# EAGLE design Uart-to-rs232 (EAGLE 6.0)
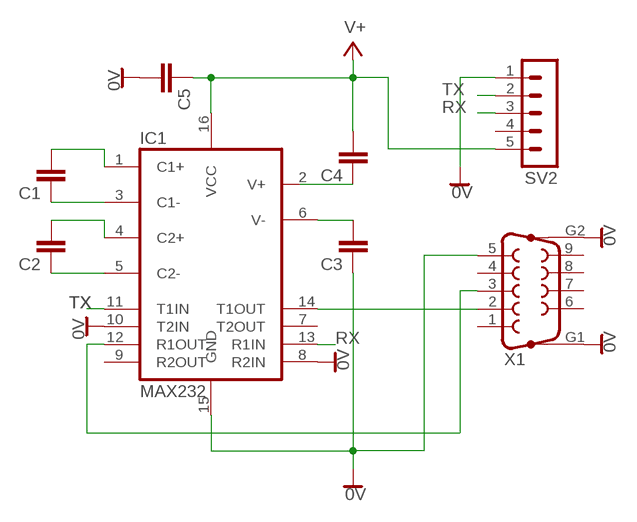
[diagram p0: schematic, sheet 1]

## Parts
C1  C0805  [C0805D]
C2  C0805  [C0805D]
C3  C0805  [C0805D]
C4  C0805  [C0805D]
C5  C0805  [C0805D]
IC1  MAX232  [DIL16]
SV2  MA05-1  [MA05-1]
X1  F09HP  [F09HP]

## Nets
0V: C3.1 C5.2 IC1.8(R2IN) IC1.10(T2IN) IC1.15(GND) SV2.1 X1.5 X1.G1 X1.G2
+5V: C4.2 C5.1 IC1.16(VCC) SV2.5 ; supply symbol labelled V+
N$1: IC1.14(T1OUT) X1.2
N$2: C1.2 IC1.1(C1+)
N$3: C1.1 IC1.3(C1-)
N$4: C2.2 IC1.4(C2+)
N$5: C2.1 IC1.5(C2-)
N$6: C3.2 IC1.6(V-)
N$7: C4.1 IC1.2(V+)
N$9: IC1.12(R1OUT) X1.3
RX: IC1.13(R1IN) SV2.3
TX: IC1.11(T1IN) SV2.2
Unconnected: IC1.7(T2OUT) IC1.9(R2OUT) SV2.4 X1.1 X1.4 X1.6 X1.7 X1.8 X1.9

## Library data of the parts
C1-C5 = den:C0805
IC1 = den:MAX232
SV2 = con-lstb:MA05-1: PIN HEADER; OC_FARNELL: unknown; OC_NEWARK: unknown
X1 = con-subd:F09HP: SUB-D; OC_FARNELL: unknown; OC_NEWARK: unknown

## Board
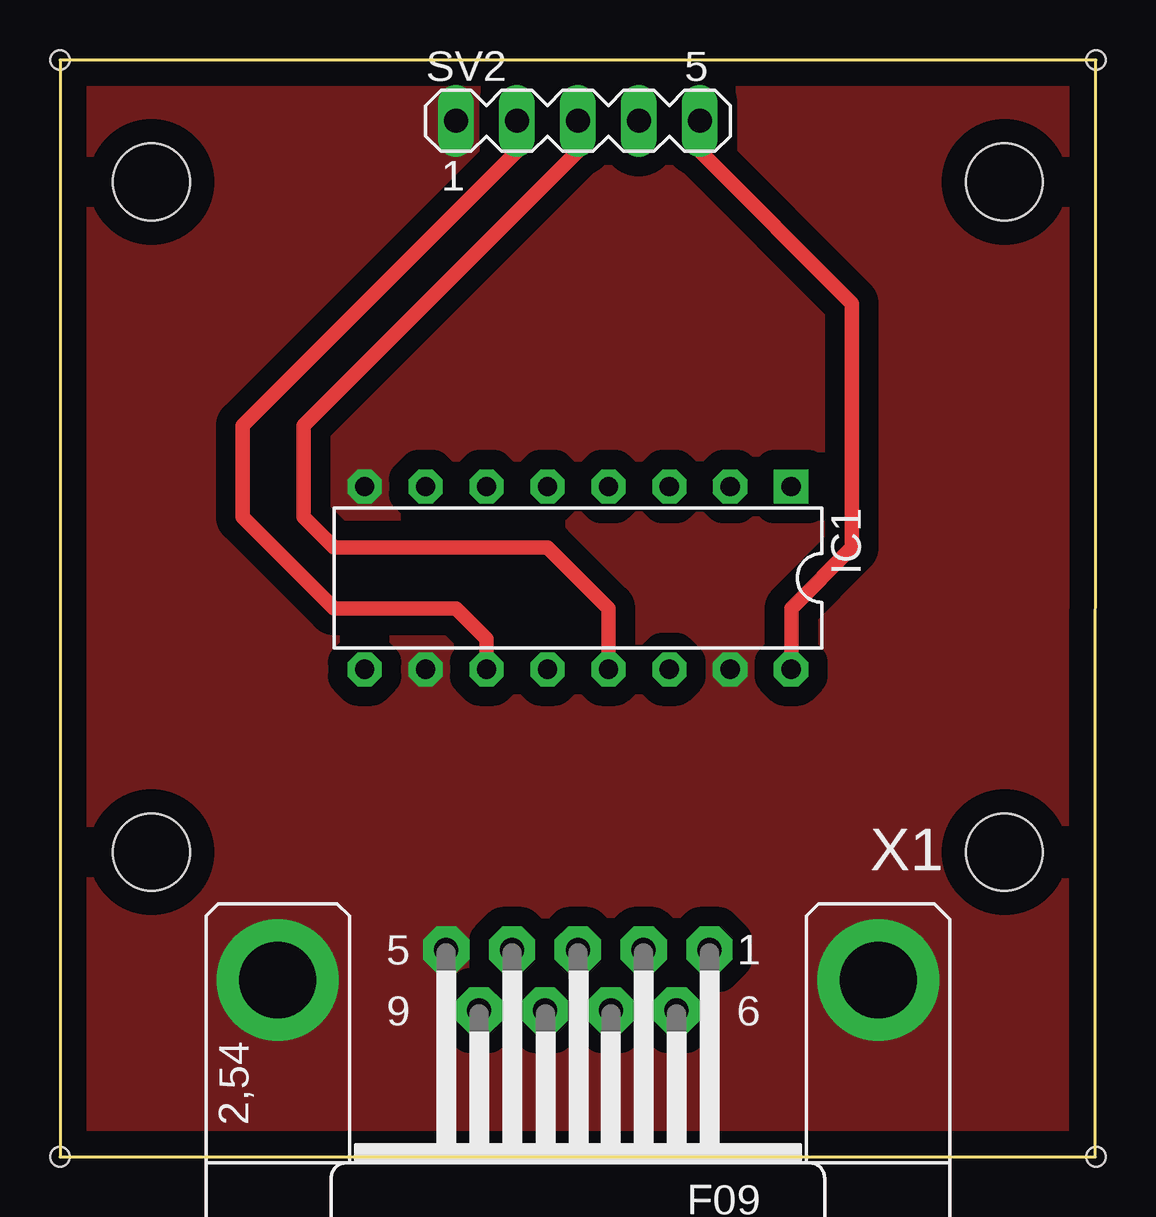
[diagram p1: board, top side]
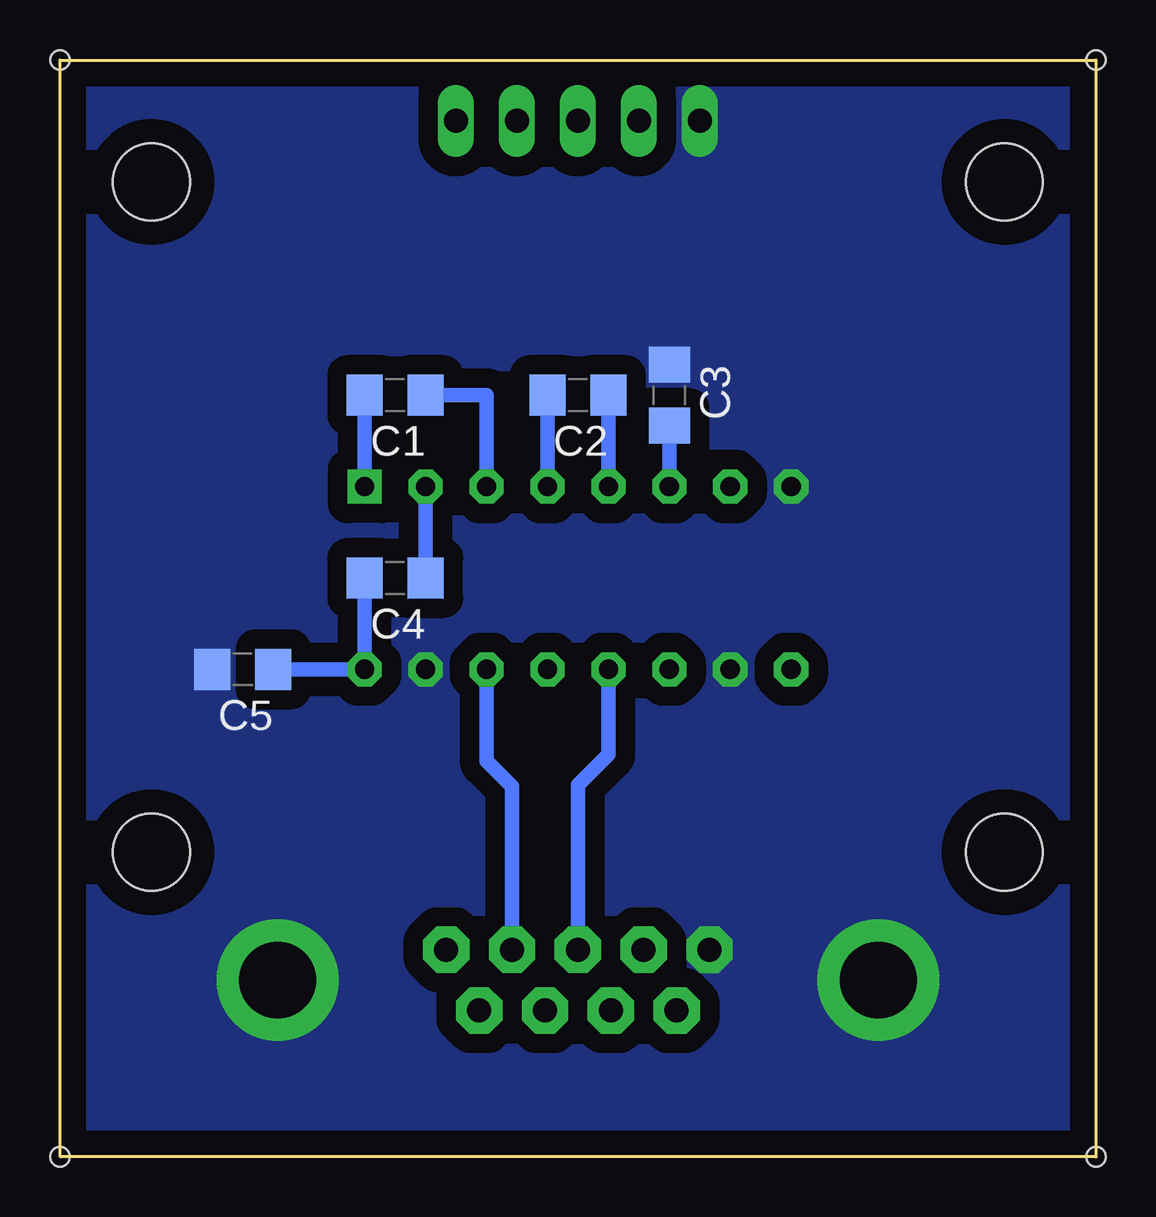
[diagram p2: board, bottom side, seen from below]

Size 43.18 x 45.72 mm. Coordinates in mm from the lower left corner, seen from the top.
Outline: 0,0 43.16,0 43.18,45.72 0,45.72 0,0
Copper layers (1*16): Top 0.035mm / dielectric 1.5mm / Bottom 0.035mm
Design rules: minimum track width 10mil, minimum drill 24mil, track to track 8mil, track to pad 8mil, pad to pad 8mil, via to via 8mil, smd to smd 8mil, copper to edge 40mil, drill to drill 8mil, minimum pad ring 10mil, minimum via ring 8mil, stop-mask expansion 4mil, vias tented up to drill 0mil, thermal gap 10mil
Holes 3.2 mm at 39.37,12.7 3.81,12.7 3.81,40.64 39.37,40.64
Holes 0.8 mm at 0,0 43.18,0 43.18,45.72 0,45.72

### Footprints (pad centres in the part's own frame; a part is rotated, then mirrored left to right if it is on the bottom)
C0805D = smd 1.5 x 1.7: 1 -1.27,0; 2 1.27,0
DIL16 = drill 0.8 pad 1.422 square: 1 -8.89,-3.81 | drill 0.8 pad 1.422 octagon: 2 -6.35,-3.81; 3 -3.81,-3.81; 4 -1.27,-3.81; 5 1.27,-3.81; 6 3.81,-3.81; 7 6.35,-3.81; 8 8.89,-3.81; 9 8.89,3.81; 10 6.35,3.81; 11 3.81,3.81; 12 1.27,3.81; 13 -1.27,3.81; 14 -3.81,3.81; 15 -6.35,3.81; 16 -8.89,3.81
MA05-1 = drill 1 long: 1 -5.08,0; 2 -2.54,0; 3 0,0; 4 2.54,0; 5 5.08,0
F09HP = drill 1 pad 1.93 octagon: 1 -5.486,-1.27; 2 -2.743,-1.27; 3 0,-1.27; 4 2.743,-1.27; 5 5.486,-1.27; 6 -4.115,1.27; 7 -1.372,1.27; 8 1.372,1.27; 9 4.115,1.27 | drill 3.2 pad 5.08: G1 -12.522,0; G2 12.522,0

### Placement (x,y rotation side)
C1  29.21,31.75 180 bottom
C2  21.59,31.75 180 bottom
C3  17.78,31.75 270 bottom
C4  29.21,24.13 180 bottom
C5  35.56,20.32 180 bottom
IC1  21.59,24.13 180 top
SV2  21.59,43.18 0 top
X1  21.59,7.37 180 top

### Tracks (layer width: path | path; a pad name or v marks a point on that pad's centre or on a via)
0V
  pour Top (isolate 0.813, no thermals): 0,0 0,45.72 43.18,45.72 43.18,0
  pour Bottom (isolate 0.813, no thermals): 0,0 0,45.72 43.18,45.72 43.18,0
+5V
  Top 0.61: IC1.16 30.48,22.86 33.02,25.4 33.02,35.56 26.67,41.91 SV2.5
  Bottom 0.61: C4.2 IC1.16 C5.1
N$1
  Bottom 0.61: IC1.14 25.4,16.51 24.33,15.44 X1.2
N$2
  Bottom 0.61: IC1.1 C1.2
N$3
  Bottom 0.61: C1.1 25.4,31.75 IC1.3
N$4
  Bottom 0.61: IC1.4 C2.2
N$5
  Bottom 0.61: IC1.5 C2.1
N$6
  Bottom 0.61: IC1.6 C3.2
N$7
  Bottom 0.61: C4.1 IC1.2
N$9
  Bottom 0.61: IC1.12 20.32,16.76 21.59,15.49 X1.3
RX
  Top 0.61: IC1.13 22.86,22.86 20.32,25.4 11.43,25.4 10.16,26.67 10.16,30.48 21.59,41.91 SV2.3
TX
  Top 0.61: IC1.11 17.78,21.59 16.51,22.86 11.43,22.86 7.62,26.67 7.62,30.48 19.05,41.91 SV2.2

### Text on the board
Drill_legend: Drill legend | Date: 05.05.2012 15:04:20 | 3.2000 mm / 125.984 mil | 1.0000 mm / 39.370 mil | 0.8000 mm / 31.496 mil